# Altium schematic sheet interfaces.schdoc
size 209 x 297 mm; Scale: 1:1; DocumentType: Ñõåìà ýëåêòðè÷åñêàÿ ïðèíöèïèàëüíàÿ; FirstReferrence: ÀÁÂÃ.123456.001; PageSetup: Record=PageOptions¦CenterHorizontal=False¦CenterVertical=False¦PrintScale=0.95¦XCorrection=0.00¦YCorrection=0.00¦PrintKind=1¦BorderSize=5000000¦LeftOffset=0¦BottomOffset=0¦Orientation=1¦PaperLength=1000¦PaperWidth=1000¦Scale=100¦PaperSource=15¦PrintQuality=600¦MediaType=1¦DitherType=10¦PaperKind=A4¦PrintScaleMode=1
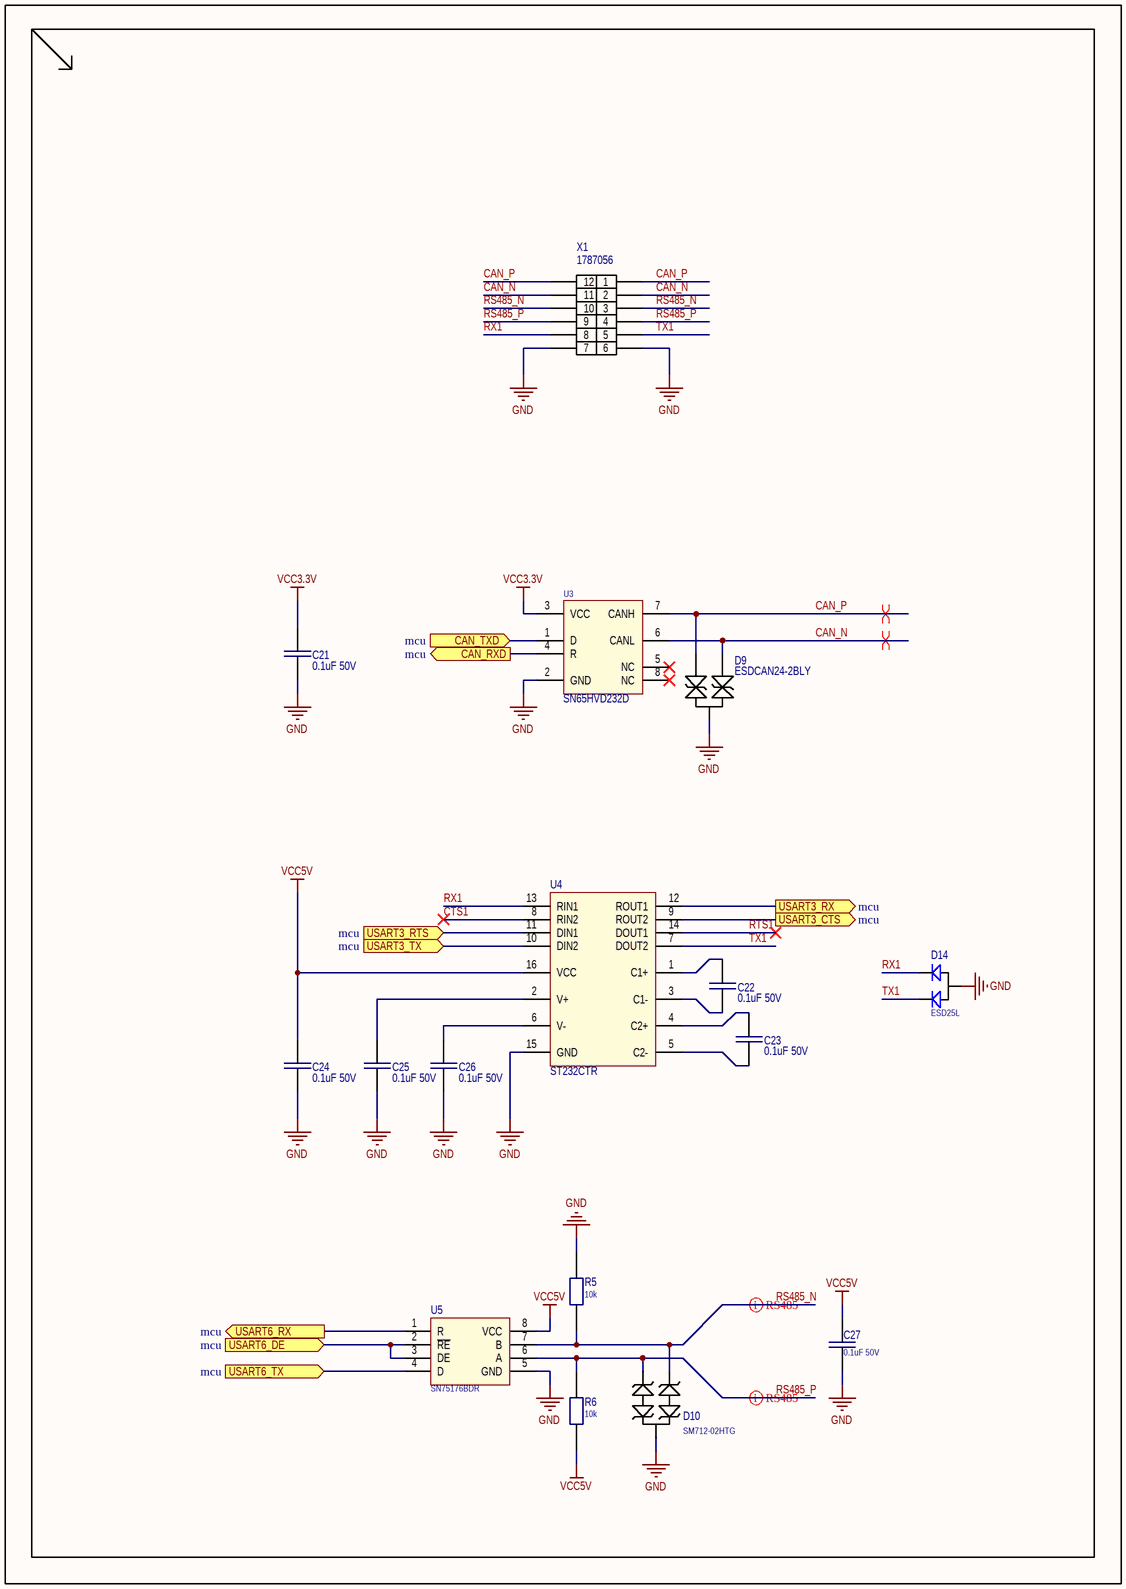
[diagram p0: interfaces.schdoc]

## Parts
C21  0.1uF 50V  [C_0603]
C22  0.1uF 50V  [C_0603]
C23  0.1uF 50V  [C_0603]
C24  0.1uF 50V  [C_0603]
C25  0.1uF 50V  [C_0603]
C26  0.1uF 50V  [C_0603]
C27  0.1uF 50V  [C_0603]
D9  ESDCAN24-2BLY  [SOT23]
D10  SM712-02HTG  [SOT23]
D14  ESD25L  [SOT23]
R5  10k  [R_0603]
R6  10k  [R_0603]
U3  SN65HVD232D  [SO-8_M]
U4  ST232CTR  [TSSOP16_STM]
U5  SN75176BDR  [SO-8]
X1  1787056  [DMC 1.5/ 6-G1F-3.5-LR P20THR 1787056]

## Ports
CAN_RXD (out, see mcu), CAN_TXD (in, see mcu), USART3_CTS (out, see mcu), USART3_RTS (in, see mcu), USART3_RX (out, see mcu), USART3_TX (in, see mcu), USART6_DE (in, see mcu), USART6_RX (out, see mcu), USART6_TX (in, see mcu)

## Nets
GND: C21.1 C24.1 C25.1 C26.1 C27.1 D9.3 D10.3 D14.3 R5.2 U3.2(GND) U4.15(GND) U5.5(GND) X1.6 X1.7
VCC3.3V: C21.2 U3.3(VCC)
VCC5V: C24.2 C27.2 R6.1 U4.16(VCC) U5.8(VCC)
CAN_N: D9.2 U3.6(CANL) X1.2 X1.11
CAN_P: D9.1 U3.7(CANH) X1.1 X1.12
CAN_RXD: U3.4(R) ; port CAN_RXD
CAN_TXD: U3.1(D) ; port CAN_TXD
CTS1: U4.8(RIN2)
RS485_N: D10.1 R5.1 U5.7(B) X1.3 X1.10
RS485_P: D10.2 R6.2 U5.6(A) X1.4 X1.9
RTS1: U4.14(DOUT1)
RX1: D14.2 U4.13(RIN1) X1.8
TX1: D14.1 U4.7(DOUT2) X1.5
USART3_CTS: U4.9(ROUT2) ; port USART3_CTS
USART3_RTS: U4.11(DIN1) ; port USART3_RTS
USART3_RX: U4.12(ROUT1) ; port USART3_RX
USART3_TX: U4.10(DIN2) ; port USART3_TX
USART6_DE: U5.2(~{RE}) U5.3(DE) ; port USART6_DE
USART6_RX: U5.1(R) ; port USART6_RX
USART6_TX: U5.4(D) ; port USART6_TX
NetC22_1: C22.1 U4.1(C1+)
NetC22_2: C22.2 U4.3(C1-)
NetC23_1: C23.1 U4.4(C2+)
NetC23_2: C23.2 U4.5(C2-)
NetC25_2: C25.2 U4.2(V+)
NetC26_2: C26.2 U4.6(V-)

Not connected (* = marked no-connect by the designer): U3 5(NC)* 8(NC)*

## Layout directives
differential pair; net class CAN: CAN_N, CAN_P
differential pair; net class RS485; differential pair class RS485: RS485_N, RS485_P

## Library data of the parts
C21 C27 = CAP_SMD: Capacitor; Part: CC0603KPX7R9BB104; Alternative Part: *; Value: 0.1uF 50V; JLCPCB Part: C14663
C22-C26 = C0603: Capacitor; Part: CC0603KPX7R9BB104; Value: 0.1uF 50V; JLCPCB Part: C14663
D9 = ESD_CAN: ESD; Value: ESDCAN24-2BLY; Part: ESDCAN24-2BLY; Alternative Part: *; JLCPCB Part: C5158050
D10 = ESD: Value: SM712-02HTG; Part: SM712-02HTG; Alternative Part: *; JLCPCB Part: C5449363
D14 = TVS_SOT23: Diode; Part: ESDA25L; JLCPCBPart: C95343; JLCPCB Part: C95343
R5 R6 = RES_SMD: Resistor; Part: RC0603JR-0710KL; Alternative Part: *; Value: 10k; JLCPCB Part: C99198
U3 = SN65HVD232D: CAN_transiever; Part: SN65HVD232DR; Alternative Part: *; JLCPCB Part: C30530
U4 = ST232CTR: Mfr_Name: STMicroelectronics; Copyright: Copyright (C) 2022 Ultra Librarian. All rights reserved.; Part: ST232CTR; RefDes: RefDes; Type: DEV; JLCPCB Part: C13482
U5 = SN75176BDR: RS485 Half Duplex Convertor; Part: SN75176BDR; JLCPCB Part: C2829048
X1 = 15EDGRHCM-THR-3.5: THR-3.5-12P; Part: 1787056; JLCPCB Part: C2923273